# EAGLE design AtMega1280Breakout (EAGLE 5.07)
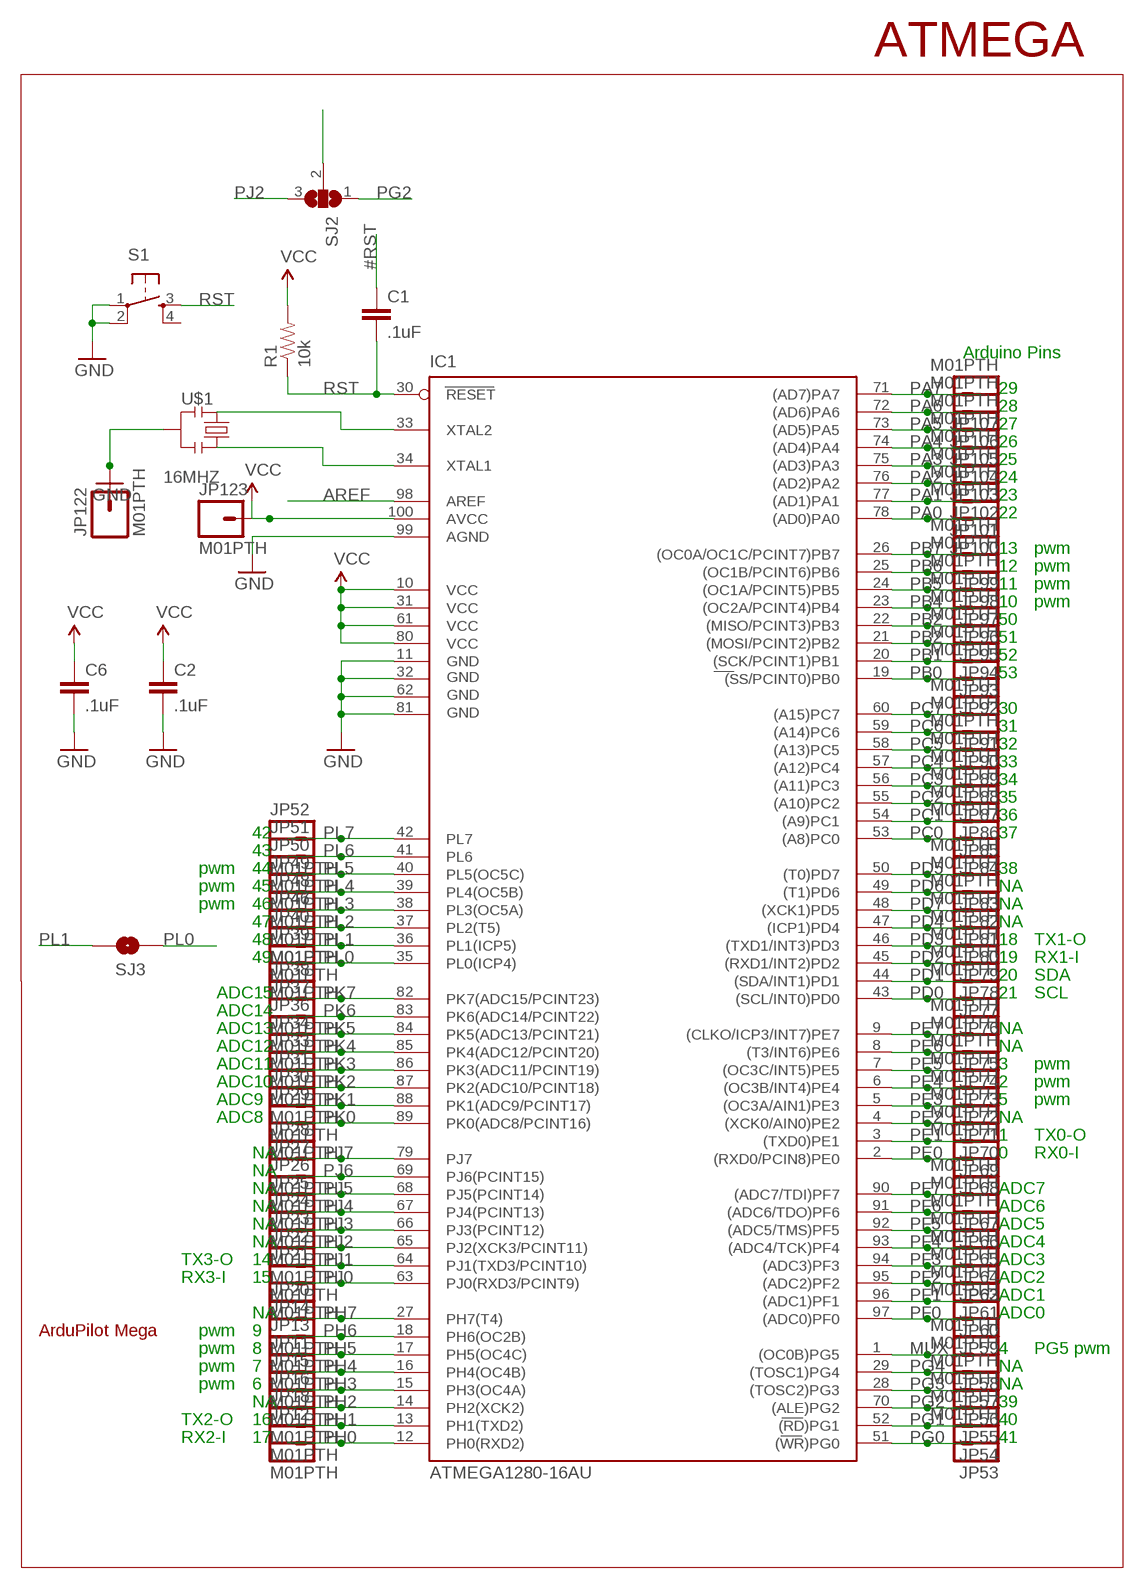
[diagram p0: schematic, sheet 1]

## Parts
C1  .1uF  CAP0402  [C0402]
C2  .1uF  CAP0402  [C0402]
C6  .1uF  CAP0402  [C0402]
IC1  ATMEGA1280-16AU  [TQFP100]
JP11  M01PTH  [1X01]
JP12  M01PTH  [1X01]
JP13  M01PTH  [1X01]
JP14  M01PTH  [1X01]
JP15  M01PTH  [1X01]
JP16  M01PTH  [1X01]
JP18  M01PTH  [1X01]
JP20  M01PTH  [1X01]
JP21  M01PTH  [1X01]
JP22  M01PTH  [1X01]
JP23  M01PTH  [1X01]
JP24  M01PTH  [1X01]
JP25  M01PTH  [1X01]
JP26  M01PTH  [1X01]
JP27  M01PTH  [1X01]
JP28  M01PTH  [1X01]
JP29  M01PTH  [1X01]
JP30  M01PTH  [1X01]
JP31  M01PTH  [1X01]
JP33  M01PTH  [1X01]
JP34  M01PTH  [1X01]
JP36  M01PTH  [1X01]
JP37  M01PTH  [1X01]
JP38  M01PTH  [1X01]
JP39  M01PTH  [1X01]
JP40  M01PTH  [1X01]
JP46  M01PTH  [1X01]
JP47  M01PTH  [1X01]
JP48  M01PTH  [1X01]
JP49  M01PTH  [1X01]
JP50  M01PTH  [1X01]
JP51  M01PTH  [1X01]
JP52  M01PTH  [1X01]
JP53  M01PTH  [1X01]
JP54  M01PTH  [1X01]
JP55  M01PTH  [1X01]
JP56  M01PTH  [1X01]
JP57  M01PTH  [1X01]
JP58  M01PTH  [1X01]
JP59  M01PTH  [1X01]
JP60  M01PTH  [1X01]
JP61  M01PTH  [1X01]
JP62  M01PTH  [1X01]
JP63  M01PTH  [1X01]
JP64  M01PTH  [1X01]
JP65  M01PTH  [1X01]
JP66  M01PTH  [1X01]
JP67  M01PTH  [1X01]
JP68  M01PTH  [1X01]
JP69  M01PTH  [1X01]
JP70  M01PTH  [1X01]
JP71  M01PTH  [1X01]
JP72  M01PTH  [1X01]
JP73  M01PTH  [1X01]
JP74  M01PTH  [1X01]
JP75  M01PTH  [1X01]
JP76  M01PTH  [1X01]
JP77  M01PTH  [1X01]
JP78  M01PTH  [1X01]
JP79  M01PTH  [1X01]
JP80  M01PTH  [1X01]
JP81  M01PTH  [1X01]
JP82  M01PTH  [1X01]
JP83  M01PTH  [1X01]
JP84  M01PTH  [1X01]
JP85  M01PTH  [1X01]
JP86  M01PTH  [1X01]
JP87  M01PTH  [1X01]
JP88  M01PTH  [1X01]
JP89  M01PTH  [1X01]
JP90  M01PTH  [1X01]
JP91  M01PTH  [1X01]
JP92  M01PTH  [1X01]
JP93  M01PTH  [1X01]
JP94  M01PTH  [1X01]
JP95  M01PTH  [1X01]
JP96  M01PTH  [1X01]
JP97  M01PTH  [1X01]
JP98  M01PTH  [1X01]
JP99  M01PTH  [1X01]
JP100  M01PTH  [1X01]
JP101  M01PTH  [1X01]
JP102  M01PTH  [1X01]
JP103  M01PTH  [1X01]
JP104  M01PTH  [1X01]
JP105  M01PTH  [1X01]
JP106  M01PTH  [1X01]
JP107  M01PTH  [1X01]
JP122  M01PTH  [1X01]
JP123  M01PTH  [1X01]
R1  10k  RESISTOR0402  [C0402]
S1  TAC_SWITCHSMD  [TACTILE_SWITCH_SMD]
SJ2  SOLDERJUMPER_2WAYS  [SJ_3]
SJ3  SOLDERJUMPERNC3  [SJ_2S-NOTRACE]
U$1  16MHZ  RESONATORSMD  [RESONATOR-SMD]

## Nets
#RST: C1.1
AREF: IC1.98(AREF)
GND: C2.2 C6.2 IC1.11(GND) IC1.32(GND1) IC1.62(GND2) IC1.81(GND3) IC1.99(AGND) JP122.1 S1.1 S1.2 U$1.2
MUX: IC1.1((OC0B)PG5) JP58.1
N$12: SJ2.2
N$56: IC1.34(XTAL1) U$1.3
N$89: IC1.33(XTAL2) U$1.1
PA0: IC1.78((AD0)PA0) JP100.1
PA1: IC1.77((AD1)PA1) JP101.1
PA2: IC1.76((AD2)PA2) JP102.1
PA3: IC1.75((AD3)PA3) JP103.1
PA4: IC1.74((AD4)PA4) JP104.1
PA5: IC1.73((AD5)PA5) JP105.1
PA6: IC1.72((AD6)PA6) JP106.1
PA7: IC1.71((AD7)PA7) JP107.1
PB0: IC1.19((SS/PCINT0)PB0) JP92.1
PB1: IC1.20((SCK/PCINT1)PB1) JP93.1
PB2: IC1.21((MOSI/PCINT2)PB2) IC1.22((MISO/PCINT3)PB3) JP94.1 JP95.1
PB4: IC1.23((OC2A/PCINT4)PB4) JP96.1
PB5: IC1.24((OC1A/PCINT5)PB5) JP97.1
PB6: IC1.25((OC1B/PCINT6)PB6) JP98.1
PB7: IC1.26((OC0A/OC1C/PCINT7)PB7) JP99.1
PC0: IC1.53((A8)PC0) JP84.1
PC1: IC1.54((A9)PC1) JP85.1
PC2: IC1.55((A10)PC2) JP86.1
PC3: IC1.56((A11)PC3) JP87.1
PC4: IC1.57((A12)PC4) JP88.1
PC5: IC1.58((A13)PC5) JP89.1
PC6: IC1.59((A14)PC6) JP90.1
PC7: IC1.60((A15)PC7) JP91.1
PD0: IC1.43((SCL/INT0)PD0) JP76.1
PD1: IC1.44((SDA/INT1)PD1) JP77.1
PD2: IC1.45((RXD1/INT2)PD2) JP78.1
PD3: IC1.46((TXD1/INT3)PD3) JP79.1
PD4: IC1.47((ICP1)PD4) JP80.1
PD5: IC1.50((T0)PD7) JP83.1
PD6: IC1.49((T1)PD6) JP82.1
PD7: IC1.48((XCK1)PD5) JP81.1
PE0: IC1.2((RXD0/PCIN8)PE0) JP68.1
PE1: IC1.3((TXD0)PE1) JP69.1
PE2: IC1.4((XCK0/AIN0)PE2) JP70.1
PE3: IC1.5((OC3A/AIN1)PE3) JP71.1
PE4: IC1.6((OC3B/INT4)PE4) JP72.1
PE5: IC1.7((OC3C/INT5)PE5) JP73.1
PE6: IC1.8((T3/INT6)PE6) JP74.1
PE7: IC1.9((CLKO/ICP3/INT7)PE7) JP75.1
PF0: IC1.97((ADC0)PF0) JP59.1
PF1: IC1.96((ADC1)PF1) JP60.1
PF2: IC1.95((ADC2)PF2) JP61.1
PF3: IC1.94((ADC3)PF3) JP62.1 JP63.1
PF4: IC1.93((ADC4/TCK)PF4) JP64.1
PF5: IC1.92((ADC5/TMS)PF5) JP65.1
PF6: IC1.91((ADC6/TDO)PF6) JP66.1
PF7: IC1.90((ADC7/TDI)PF7) JP67.1
PG0: IC1.51((WR)PG0) JP53.1
PG1: IC1.52((RD)PG1) JP54.1
PG2: IC1.70((ALE)PG2) JP55.1 SJ2.1
PG3: IC1.28((TOSC2)PG3) JP56.1
PG4: IC1.29((TOSC1)PG4) JP57.1
PH0: IC1.12(PH0(RXD2)) JP12.1
PH1: IC1.13(PH1(TXD2)) JP18.1
PH2: IC1.14(PH2(XCK2)) JP16.1
PH3: IC1.15(PH3(OC4A)) JP15.1
PH4: IC1.16(PH4(OC4B)) JP11.1
PH5: IC1.17(PH5(OC4C)) JP13.1
PH6: IC1.18(PH6(OC2B)) JP14.1
PH7: IC1.27(PH7(T4)) JP20.1
PJ0: IC1.63(PJ0(RXD3/PCINT9)) JP21.1
PJ1: IC1.64(PJ1(TXD3/PCINT10)) JP22.1
PJ2: IC1.65(PJ2(XCK3/PCINT11)) JP23.1 SJ2.3
PJ3: IC1.66(PJ3(PCINT12)) JP24.1
PJ4: IC1.67(PJ4(PCINT13)) JP25.1
PJ5: IC1.68(PJ5(PCINT14)) JP26.1
PJ6: IC1.69(PJ6(PCINT15)) JP27.1
PJ7: IC1.79(PJ7) JP28.1
PK0: IC1.89(PK0(ADC8/PCINT16)) JP29.1
PK1: IC1.88(PK1(ADC9/PCINT17)) JP30.1
PK2: IC1.87(PK2(ADC10/PCINT18)) JP31.1
PK3: IC1.86(PK3(ADC11/PCINT19)) JP33.1
PK4: IC1.85(PK4(ADC12/PCINT20)) JP34.1
PK5: IC1.84(PK5(ADC13/PCINT21)) JP36.1
PK6: IC1.83(PK6(ADC14/PCINT22)) JP37.1
PK7: IC1.82(PK7(ADC15/PCINT23)) JP38.1
PL0: IC1.35(PL0(ICP4)) JP39.1 SJ3.1
PL1: IC1.36(PL1(ICP5)) JP40.1 SJ3.2
PL2: IC1.37(PL2(T5)) JP46.1 JP47.1
PL3: IC1.38(PL3(OC5A)) JP48.1
PL4: IC1.39(PL4(OC5B)) JP49.1
PL5: IC1.40(PL5(OC5C)) JP50.1
PL6: IC1.41(PL6) JP51.1
PL7: IC1.42(PL7) JP52.1
RST: C1.2 IC1.30(RESET) R1.1 S1.3
VCC: C2.1 C6.1 IC1.10(VCC) IC1.31(VCC1) IC1.61(VCC2) IC1.80(VCC3) IC1.100(AVCC) JP123.1 R1.2
Unconnected: S1.4

## Notes on the sheet
- ATMEGA
- Arduino Pins
- 29
- 28
- 27
- 26
- 25
- 24
- 23
- 22
- 13 | pwm
- 12 | pwm
- 11 | pwm
- 10 | pwm
- 50
- 51
- 52
- 53
- 30
- 31
- 32
- 33
- 34
- 35
- 36
- 42 | 37
- 43
- pwm | 44 | 38
- pwm | 45 | NA
- pwm | 46 | NA
- 47 | NA
- 48 | 18 | TX1-O
- 49 | 19 | RX1-I
- 20 | SDA
- ADC15 | 21 | SCL
- ADC14
- ADC13 | NA
- ADC12 | NA
- ADC11 | 3 | pwm
- ADC10 | 2 | pwm
- ADC9 | 5 | pwm
- ADC8 | NA
- 1 | TX0-O
- NA | 0 | RX0-I
- NA
- NA | ADC7
- NA | ADC6
- NA | ADC5
- NA | ADC4
- TX3-O | 14 | ADC3
- RX3-I | 15 | ADC2
- ADC1
- NA | ADC0
- ArduPilot Mega | pwm | 9
- pwm | 8 | 4 | PG5 pwm
- pwm | 7 | NA
- pwm | 6 | NA
- NA | 39
- TX2-O | 16 | 40
- RX2-I | 17 | 41

## Library data of the parts
C1 C2 C6 = DIYdrones3:CAP: Capacitor Standard 0603 ceramic capacitor, and 0.1" leaded capacitor.
IC1 = atmel-2010:ATMEGA*: MICROCONTROLLER 64/128/256 Kbytes FLASH 4 Kbytes EEPROM 8 Kbytes SRAM 86 General Purpose I/O pins 12-channels16-bit PWM 4 x Serial USARTs 16-channels 10-bit A/D
JP11-JP16 JP18 JP20-JP31 JP33 JP34 JP36-JP40 JP46-JP107 JP122 JP123 = DIYdrones3:M01: Header 1 Standard 1-pin 0.1" header. Use with straight break away headers (SKU : PRT-00116), right angle break away headers (PRT-00553), swiss pins (PRT-00743), machine pins (PRT-00117), and female headers (PRT-00115).
R1 = DIYdrones3:RESISTOR: Resistor Basic schematic elements and footprints for 0603, 1206, and PTH 1/10th watt (small) resistors.
S1 = DIYdrones3:TAC_SWITCH: Momentary Switch Button commonly used for reset or general input. Spark Fun Electronics SKU : COM-00097
SJ2 = DIYdrones3:SOLDERJUMPER_2WAY: Solder Jumper 2 way solder jumper
SJ3 = DIYdrones3:SOLDERJUMPER: Solder Jumper Standard SMD solder jumper. Used to automate production. Two varients : Normally Open and Normally Closed are the same, but have different paste layers. NC will have a large amount of paste and should jumper during reflow.
U$1 = DIYdrones3:RESONATOR: Resonator Small SMD resonator. This is the itty bitty 10/20MHz resonators with built in caps. CSTCE10M0G55 and CSTCE20M0V53. Footprint has been reviewed closely but hasn't been tested yet.

## Board
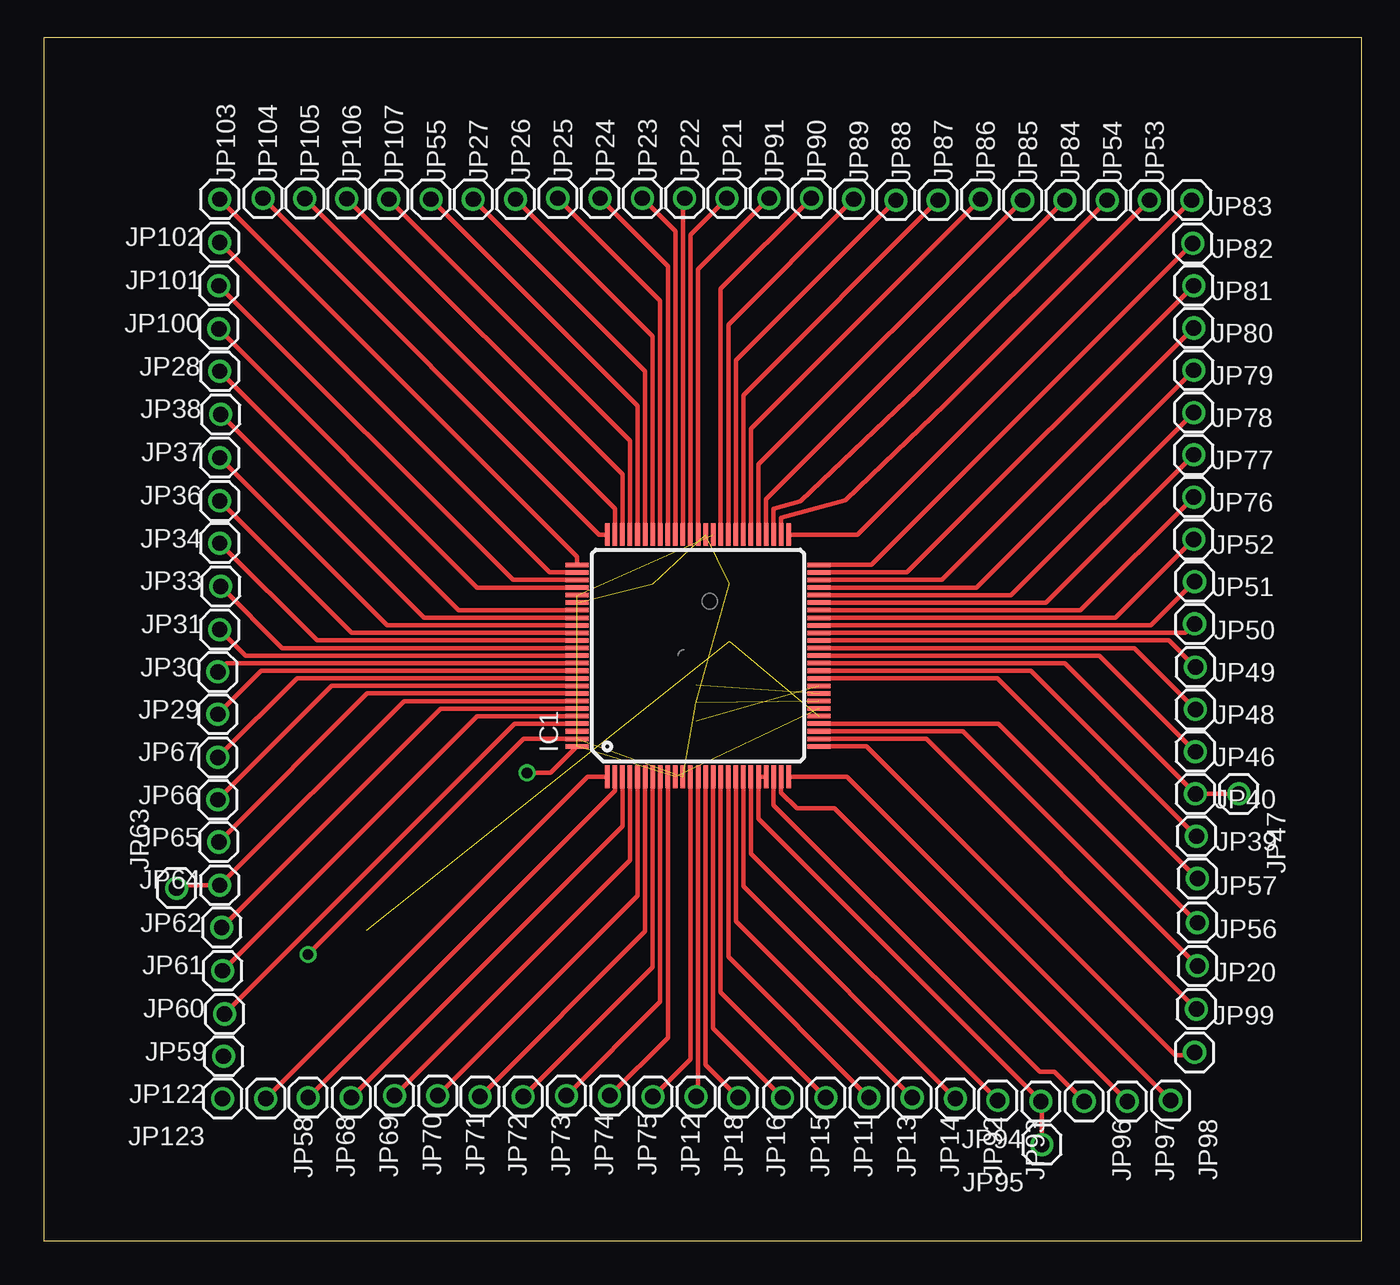
[diagram p1: board, top side]
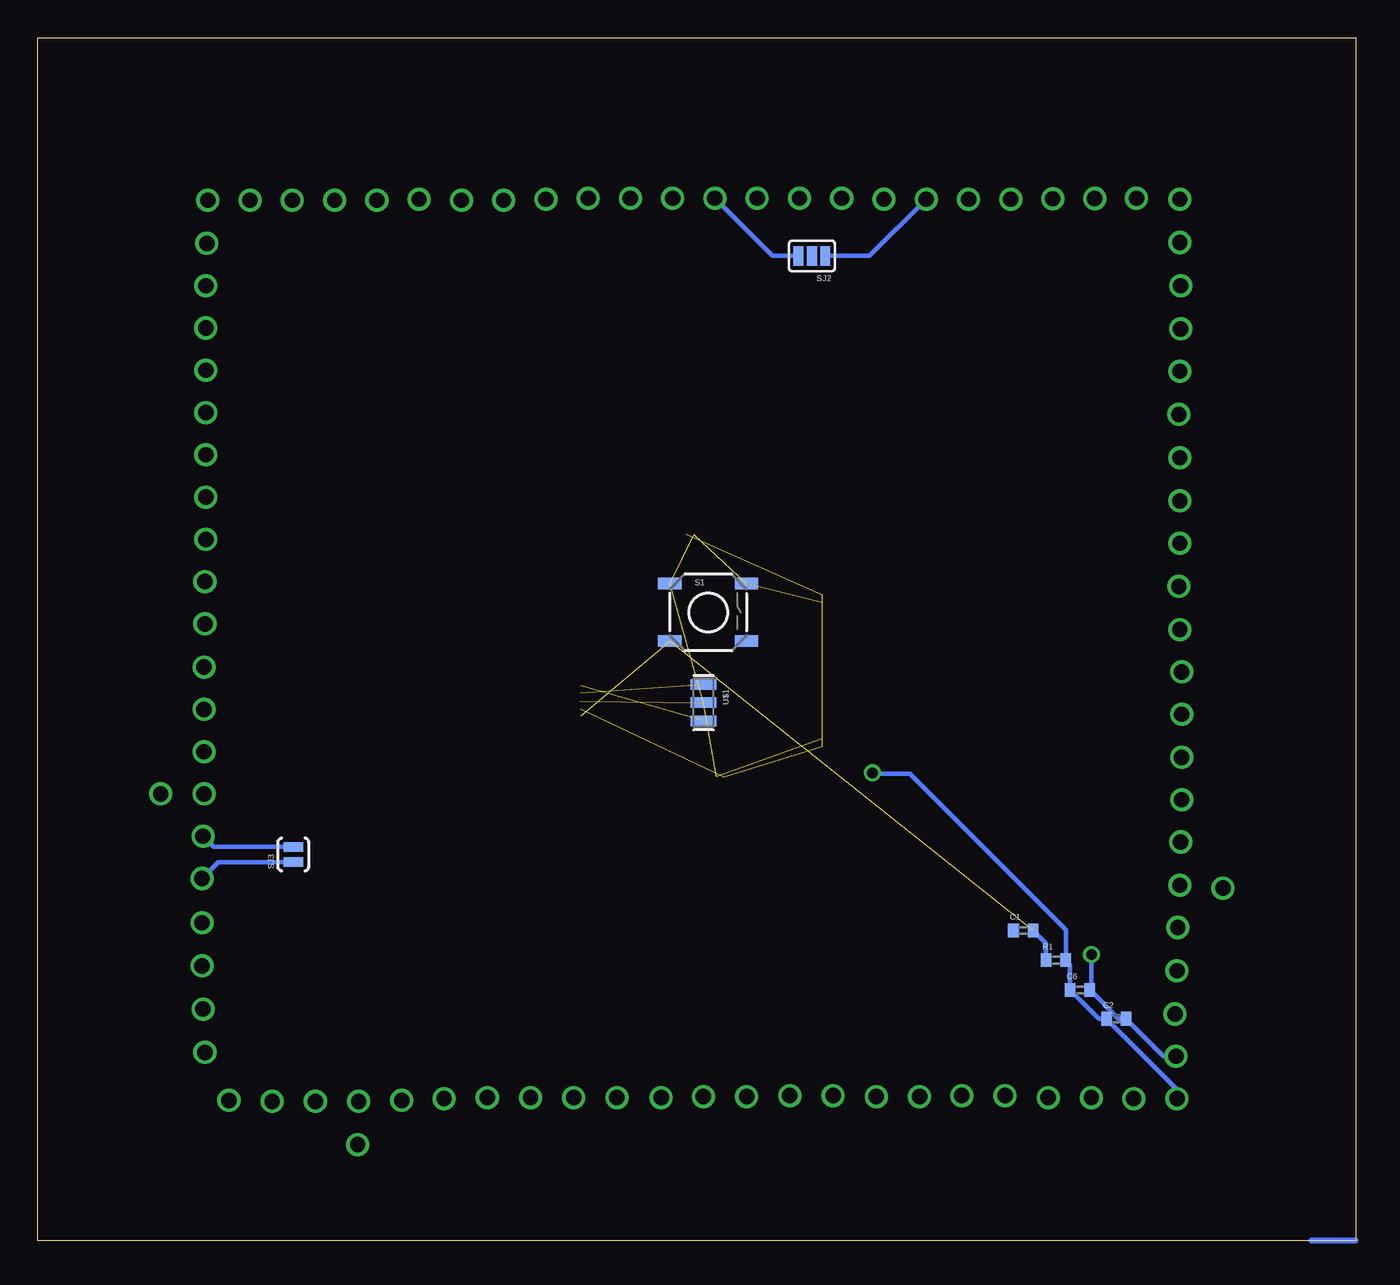
[diagram p2: board, bottom side, seen from below]

Size 87.12 x 79.5 mm. Coordinates in mm from the lower left corner, seen from the top.
Outline: 0,0 87.12,0 87.12,79.5 0,79.5 0,0
Copper layers (1*16): Top 0.035mm / dielectric 1.5mm / Bottom 0.035mm
Design rules "default": minimum track width 10mil, minimum drill 0.6mm, track to track 8mil, track to pad 8mil, pad to pad 8mil, via to via 8mil, smd to smd 8mil, copper to edge 40mil, drill to drill 8mil, minimum pad ring 10mil, minimum via ring 8mil, stop-mask expansion 4mil, vias tented up to drill 0mil, thermal gap 10mil

### Footprints (pad centres in the part's own frame; a part is rotated, then mirrored left to right if it is on the bottom)
C0402 = smd 0.7 x 0.9: 1 -0.65,0; 2 0.65,0
TQFP100 = smd 1.5 x 0.3: 1 -8,6; 2 -8,5.5; 3 -8,5; 4 -8,4.5; 5 -8,4; 6 -8,3.5; 7 -8,3; 8 -8,2.5; 9 -8,2; 10 -8,1.5; 11 -8,1; 12 -8,0.5; 13 -8,0; 14 -8,-0.5; 15 -8,-1; 16 -8,-1.5; 17 -8,-2; 18 -8,-2.5; 19 -8,-3; 20 -8,-3.5; 21 -8,-4; 22 -8,-4.5; 23 -8,-5; 24 -8,-5.5; 25 -8,-6; 51 8,-6; 52 8,-5.5; 53 8,-5; 54 8,-4.5; 55 8,-4; 56 8,-3.5; 57 8,-3; 58 8,-2.5; 59 8,-2; 60 8,-1.5; 61 8,-1; 62 8,-0.5; 63 8,0; 64 8,0.5; 65 8,1; 66 8,1.5; 67 8,2; 68 8,2.5; 69 8,3; 70 8,3.5; 71 8,4; 72 8,4.5; 73 8,5; 74 8,5.5; 75 8,6 | smd 0.3 x 1.5: 26 -6,-8; 27 -5.5,-8; 28 -5,-8; 29 -4.5,-8; 30 -4,-8; 31 -3.5,-8; 32 -3,-8; 33 -2.5,-8; 34 -2,-8; 35 -1.5,-8; 36 -1,-8; 37 -0.5,-8; 38 0,-8; 39 0.5,-8; 40 1,-8; 41 1.5,-8; 42 2,-8; 43 2.5,-8; 44 3,-8; 45 3.5,-8; 46 4,-8; 47 4.5,-8; 48 5,-8; 49 5.5,-8; 50 6,-8; 76 6,8; 77 5.5,8; 78 5,8; 79 4.5,8; 80 4,8; 81 3.5,8; 82 3,8; 83 2.5,8; 84 2,8; 85 1.5,8; 86 1,8; 87 0.5,8; 88 0,8; 89 -0.5,8; 90 -1,8; 91 -1.5,8; 92 -2,8; 93 -2.5,8; 94 -3,8; 95 -3.5,8; 96 -4,8; 97 -4.5,8; 98 -5,8; 99 -5.5,8; 100 -6,8
1X01 = drill 1.016 round: 1 0,0
TACTILE_SWITCH_SMD = smd 1.524 x 0.762: 1 -2.54,1.905; 2 2.54,1.905; 3 -2.54,-1.905; 4 2.54,-1.905
SJ_3 = smd 0.635 x 1.27: 1 -0.889,0; 2 0,0; 3 0.889,0
SJ_2S-NOTRACE = smd 0.635 x 1.27: 1 -0.508,0; 2 0.508,0
RESONATOR-SMD = smd 0.7 x 1.7: 1 -1.2,0; 2 0,0; 3 1.2,0

### Placement (x,y rotation side)
C1  21.97,20.51 0 bottom
C2  15.81,14.67 0 bottom
C6  18.22,16.57 0 bottom
IC1  43.24,38.67 90 top
JP11  51.69,9.46 270 top
JP12  40.26,9.53 270 top
JP13  54.55,9.46 270 top
JP14  57.4,9.46 270 top
JP15  48.83,9.46 270 top
JP16  45.91,9.46 270 top
JP18  43.12,9.53 270 top
JP20  76.2,15.3 0 top
JP21  47.94,68.9 90 top
JP22  45.15,68.9 90 top
JP23  42.35,68.9 90 top
JP24  39.56,68.9 90 top
JP25  36.77,68.9 90 top
JP26  33.97,68.9 90 top
JP27  31.18,68.83 90 top
JP28  11.56,60.26 180 top
JP29  11.49,37.59 180 top
JP30  11.62,40.39 180 top
JP31  11.68,43.24 180 top
JP33  11.62,46.1 180 top
JP34  11.62,48.9 180 top
JP36  11.62,51.75 180 top
JP37  11.68,54.61 180 top
JP38  11.62,57.47 180 top
JP39  76.26,23.94 0 top
JP40  76.2,26.73 0 top
JP46  76.14,29.53 0 top
JP47  78.99,29.53 270 top
JP48  76.14,32.32 0 top
JP49  76.14,35.12 0 top
JP50  76.14,37.91 0 top
JP51  76.07,40.77 0 top
JP52  76.07,43.56 0 top
JP53  75.88,68.77 90 top
JP54  73.09,68.77 90 top
JP55  28.38,68.83 90 top
JP56  76.26,18.16 0 top
JP57  76.26,21.02 0 top
JP58  14.67,9.4 270 top
JP59  11.94,14.99 180 top
JP60  11.81,17.84 180 top
JP61  11.75,20.7 180 top
JP62  11.62,23.5 180 top
JP63  8.76,23.3 90 top
JP64  11.56,26.35 180 top
JP65  11.49,29.15 180 top
JP66  11.49,31.94 180 top
JP67  11.49,34.8 180 top
JP68  17.46,9.46 270 top
JP69  20.32,9.46 270 top
JP70  23.18,9.59 270 top
JP71  26.04,9.59 270 top
JP72  28.83,9.53 270 top
JP73  31.69,9.53 270 top
JP74  34.54,9.59 270 top
JP75  37.4,9.59 270 top
JP76  76.01,46.35 0 top
JP77  76.01,49.15 0 top
JP78  76.01,51.94 0 top
JP79  76.01,54.74 0 top
JP80  76.01,57.53 0 top
JP81  76.01,60.33 0 top
JP82  76.01,63.12 0 top
JP83  75.95,65.91 0 top
JP84  70.29,68.77 90 top
JP85  67.5,68.77 90 top
JP86  64.71,68.77 90 top
JP87  61.91,68.83 90 top
JP88  59.12,68.77 90 top
JP89  56.32,68.77 90 top
JP90  53.53,68.83 90 top
JP91  50.74,68.9 90 top
JP92  60.26,9.4 270 top
JP93  63.06,9.27 270 top
JP94  65.91,9.21 180 top
JP95  65.98,6.35 180 top
JP96  68.77,9.21 270 top
JP97  71.63,9.21 270 top
JP98  74.49,9.27 270 top
JP99  76.07,12.45 0 top
JP100  11.56,63.12 180 top
JP101  11.62,65.98 180 top
JP102  11.62,68.83 180 top
JP103  14.48,68.9 90 top
JP104  17.25,68.88 90 top
JP105  20.02,68.87 90 top
JP106  22.8,68.83 90 top
JP107  25.59,68.83 90 top
JP122  11.87,12.19 180 top
JP123  11.81,9.4 180 top
R1  19.81,18.54 0 bottom
S1  42.8,41.53 0 bottom
SJ2  35.94,65.09 180 bottom
SJ3  70.23,25.53 90 bottom
U$1  43.12,35.56 270 bottom

### Tracks (layer width: path | path; a pad name or v marks a point on that pad's centre or on a via)
GND  (via drill 0.7)  (7 unrouted)
  Top 0.305: IC1.99 31.71,33.17 v17.46,18.92
  Bottom 0.305: 15.18,14.67 C2.2 | 15.18,14.67 12.7,12.19 JP122.1 | 15.18,14.67 15.67,14.67 C6.2 17.46,16.69 v17.46,18.92
MUX
  Top 0.305: JP58.1 35.94,30.67 IC1.1
N$1
  Bottom 0.406: 0,0 2.92,0
N$56  (1 unrouted)
N$89  (1 unrouted)
PA0
  Top 0.305: JP100.1 31,43.67 IC1.78
PA1
  Top 0.305: JP101.1 33.42,44.17 IC1.77
PA2
  Top 0.305: JP102.1 35.24,45.21 IC1.76
PA3
  Top 0.305: JP103.1 36.7,46.67 IC1.75
PA4
  Top 0.305: JP104.1 37.74,48.39 IC1.74
PA5
  Top 0.305: JP105.1 38.24,50.64 IC1.73
PA6
  Top 0.305: JP106.1 38.74,52.89 IC1.72
PA7
  Top 0.305: JP107.1 39.24,55.18 IC1.71
PB0
  Top 0.305: JP92.1 46.24,23.42 IC1.19
PB1
  Top 0.305: JP93.1 46.74,25.58 IC1.20
PB2
  Top 0.305: JP95.1 65.98,9.14 JP94.1 47.24,27.88 IC1.21 IC1.22
PB4
  Top 0.305: IC1.23 48.24,28.78 65.85,11.18 66.8,11.18 JP96.1
PB5
  Top 0.305: JP97.1 52.26,28.57 49.78,28.57 48.74,29.62 IC1.24
PB6
  Top 0.305: JP98.1 53.09,30.67 IC1.25
PB7
  Top 0.305: IC1.26 54.39,32.67 74.8,12.26 76.52,12.26 76.58,12.32 76.2,12.32 JP99.1
PC0
  Top 0.305: IC1.53 48.24,48.37 50.02,48.88 57.72,56.2 JP84.1
PC1
  Top 0.305: JP85.1 47.74,49.01 IC1.54
PC2
  Top 0.305: JP86.1 47.24,51.31 IC1.55
PC3
  Top 0.305: JP87.1 46.74,53.66 IC1.56
PC4
  Top 0.305: JP88.1 46.24,55.9 IC1.57
PC5
  Top 0.305: JP89.1 45.74,58.19 IC1.58
PC6
  Top 0.305: JP90.1 45.24,60.55 IC1.59
PC7
  Top 0.305: JP91.1 44.74,62.9 IC1.60
PD0
  Top 0.305: JP76.1 70.83,41.17 IC1.43
PD1
  Top 0.305: JP77.1 68.53,41.67 IC1.44
PD2
  Top 0.305: JP78.1 66.24,42.17 IC1.45
PD3
  Top 0.305: JP79.1 63.94,42.67 IC1.46
PD4
  Top 0.305: JP80.1 61.65,43.17 IC1.47
PD5
  Top 0.305: JP83.1 54.7,44.67 IC1.50
PD6
  Top 0.305: JP82.1 57.06,44.17 IC1.49
PD7
  Top 0.305: JP81.1 59.36,43.67 IC1.48
PE0
  Top 0.305: JP68.1 37.74,29.74 IC1.2
PE1
  Top 0.305: JP69.1 38.24,27.39 IC1.3
PE2
  Top 0.305: JP70.1 38.74,25.15 IC1.4
PE3
  Top 0.305: JP71.1 39.24,22.8 IC1.5
PE4
  Top 0.305: JP72.1 39.74,20.44 IC1.6
PE5
  Top 0.305: JP73.1 40.24,18.08 IC1.7
PE6
  Top 0.305: JP74.1 40.74,15.79 IC1.8
PE7
  Top 0.305: JP75.1 41.24,13.43 IC1.9
PF0
  Top 0.305: JP59.1 31.12,34.17 IC1.97
PF1
  Top 0.305: JP60.1 28.64,34.67 IC1.96
PF2
  Top 0.305: JP61.1 26.22,35.17 IC1.95
PF3
  Top 0.305: IC1.94 23.8,35.67 JP62.1 8.95,23.5 JP63.1
PF4
  Top 0.305: JP64.1 21.38,36.17 IC1.93
PF5
  Top 0.305: JP65.1 19.02,36.67 IC1.92
PF6
  Top 0.305: JP66.1 16.72,37.17 IC1.91
PF7
  Top 0.305: JP67.1 14.37,37.67 IC1.90
PG0
  Top 0.305: IC1.51 53.78,46.67 JP53.1
PG1
  Top 0.305: IC1.52 48.74,47.79 53,48.93 59.63,55.31 JP54.1
PG2
  Top 0.305: JP55.1 39.74,57.48 IC1.70
  Bottom 0.305: JP55.1 32.13,65.09 SJ2.1
PG3
  Top 0.305: JP56.1 60.75,33.67 IC1.28
PG4
  Top 0.305: JP57.1 63.11,34.17 IC1.29
PH0
  Top 0.305: JP12.1 42.74,12.01 IC1.12
PH1
  Top 0.305: JP18.1 43.24,9.65 IC1.13
PH2
  Top 0.305: JP16.1 43.74,11.63 IC1.14
PH3
  Top 0.305: JP15.1 44.24,14.05 IC1.15
PH4
  Top 0.305: JP11.1 44.74,16.41 IC1.16
PH5
  Top 0.305: JP13.1 45.24,18.77 IC1.17
PH6
  Top 0.305: JP14.1 45.74,21.12 IC1.18
PH7
  Top 0.305: JP20.1 58.33,33.17 IC1.27
PJ0
  Top 0.305: JP21.1 43.24,64.2 IC1.63
PJ1
  Top 0.305: JP22.1 42.74,66.49 IC1.64
PJ2
  Top 0.305: JP23.1 42.24,68.79 IC1.65
  Bottom 0.305: SJ2.3 38.54,65.09 JP23.1
PJ3
  Top 0.305: JP24.1 41.74,66.72 IC1.66
PJ4
  Top 0.305: JP25.1 41.24,64.42 IC1.67
PJ5
  Top 0.305: JP26.1 40.74,62.13 IC1.68
PJ6
  Top 0.305: JP27.1 40.24,59.77 IC1.69
PJ7
  Top 0.305: JP28.1 28.65,43.17 IC1.79
PK0
  Top 0.305: JP29.1 12.07,38.17 IC1.89
PK1
  Top 0.305: JP30.1 13.34,38.67 IC1.88
PK2
  Top 0.305: JP31.1 15.76,39.17 IC1.87
PK3
  Top 0.305: JP33.1 18.05,39.67 IC1.86
PK4
  Top 0.305: JP34.1 20.34,40.17 IC1.85
PK5
  Top 0.305: JP36.1 22.7,40.67 IC1.84
PK6
  Top 0.305: JP37.1 25.12,41.17 IC1.83
PK7
  Top 0.305: JP38.1 27.42,41.67 IC1.82
PL0
  Top 0.305: JP39.1 63.03,37.17 IC1.35
  Bottom 0.305: SJ3.1 75.18,25.02 JP39.1
PL1
  Top 0.305: JP40.1 65.26,37.67 IC1.36
  Bottom 0.305: SJ3.2 75.5,26.04 JP40.1
PL2
  Top 0.305: JP47.1 JP46.1 67.49,38.17 IC1.37
PL3
  Top 0.305: JP48.1 69.79,38.67 IC1.38
PL4
  Top 0.305: JP49.1 72.08,39.17 IC1.39
PL5
  Top 0.305: JP50.1 74.37,39.67 IC1.40
PL6
  Top 0.305: JP51.1 75.48,40.17 IC1.41
PL7
  Top 0.305: JP52.1 73.18,40.67 IC1.42
RST  (2 unrouted)
  Bottom 0.305: R1.1 20.46,19.65 C1.2
VCC  (via drill 0.7)  (4 unrouted)
  Top 0.305: v31.94,30.92 33.5,30.92 IC1.100
  Bottom 0.305: JP123.1 11.81,10.02 C2.1 16.97,14.67 C6.1 18.88,18.25 R1.2 19.16,20.56 29.46,30.86 31.88,30.86 v31.94,30.92